# EAGLE design power_node (EAGLE 6.5.0)
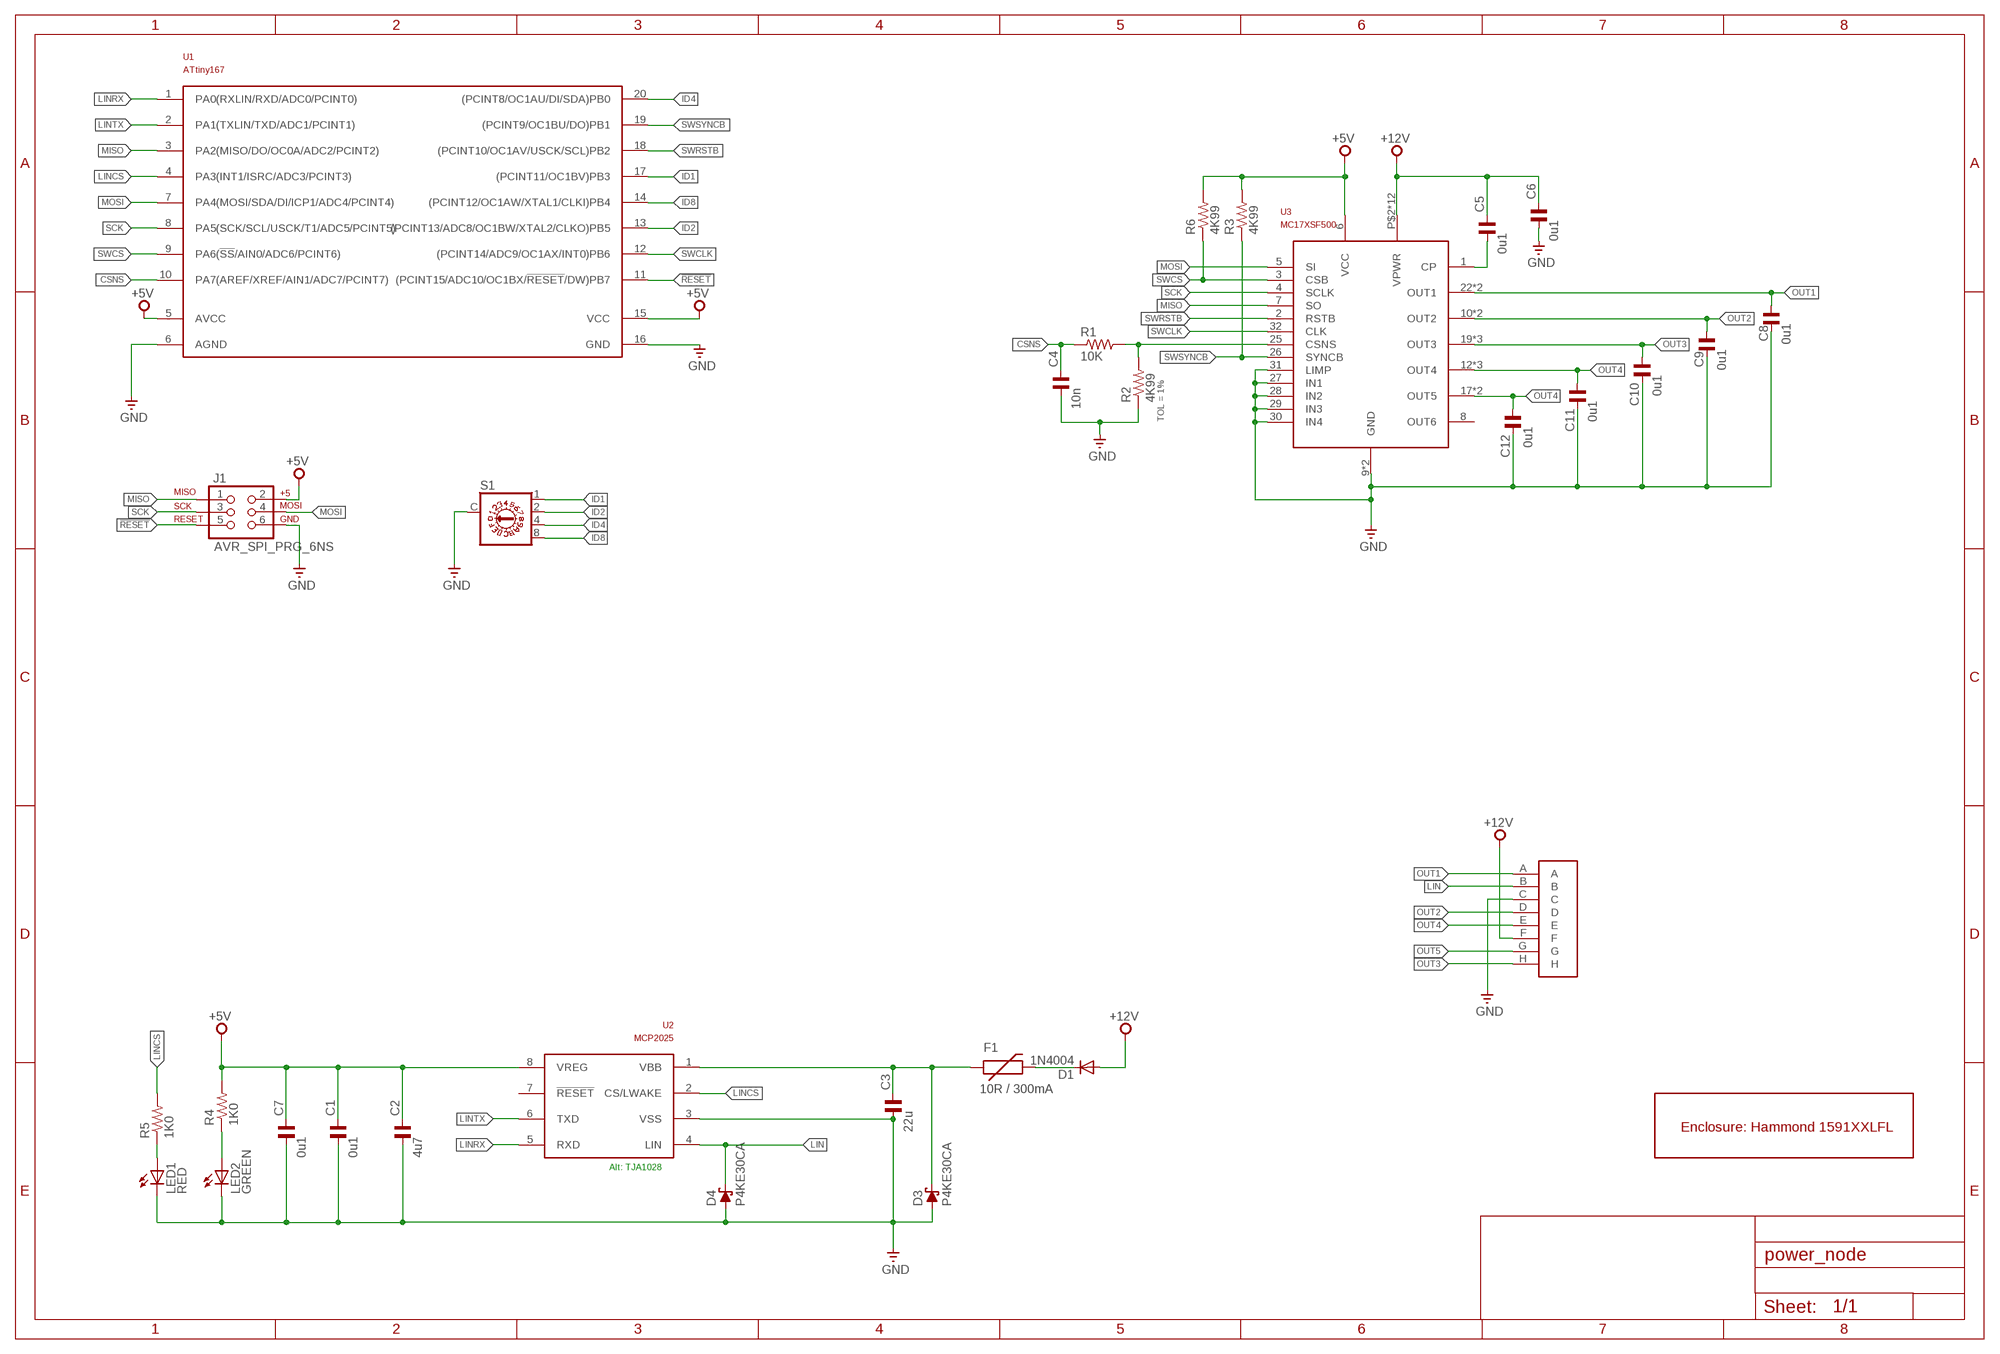
[diagram p0: schematic, sheet 1]

## Parts
C1  0u1  C-EU050-024X044  [C050-024X044]
C2  4u7  C-EU050-024X044  [C050-024X044]
C3  22u  C-EU050-024X044  [C050-024X044]
C4  10n  C-EU025-024X044  [C025-024X044]
C5  0u1  C-EU050-024X044  [C050-024X044]
C6  0u1  C-EU050-024X044  [C050-024X044]
C7  0u1  C-EU050-024X044  [C050-024X044]
C8  0u1  C-EUC0603K  [C0603K]
C9  0u1  C-EUC0603K  [C0603K]
C10  0u1  C-EUC0603K  [C0603K]
C11  0u1  C-EUC0603K  [C0603K]
C12  0u1  C-EUC0603K  [C0603K]
D1  1N4004  [DO41-10]
D3  P4KE30CA  P4KEXX  [DO41-10]
D4  P4KE30CA  P4KEXX  [DO41-10]
F1  10R / 300mA  PTCPTH  [PTC]
J1  AVR_SPI_PRG_6NS  [2X3-NS]
J2  12146734  [12146734]
LED1  RED  LED3MM  [LED3MM]
LED2  GREEN  LED3MM  [LED3MM]
R1  10K  R-EU_0207/10  [0207/10]
R2  4K99  R-EU_0207/10  [0207/10]
R3  4K99  R-EU_0207/10  [0207/10]
R4  1K0  R-EU_0207/10  [0207/10]
R5  1K0  R-EU_0207/10  [0207/10]
R6  4K99  R-EU_0207/10  [0207/10]
S1  P103  [P103]
U1  ATtiny167  ATTINY167  [SO20W]
U2  MCP2025  [SO08]
U3  MC17XSF500  [SOIC32W-EP]
U$1  1591XXLFL  [1591XXLFL]

## Nets
!RESET: J1.5 U1.11((PCINT15/ADC10/OC1BX/!RESET!/DW)PB7)
+5V [power]: C1.1 C2.1 C7.1 J1.2 R3.2 R4.2 R6.2 U1.5(AVCC) U1.15(VCC) U2.8(VREG) U3.6(VCC)
+12V [power]: C5.1 C6.1 D1.A J2.F U3.P$2(VPWR) U3.P$3(VPWR) U3.P$4(VPWR) U3.P$5(VPWR) U3.P$6(VPWR) U3.P$7(VPWR) U3.P$8(VPWR) U3.P$9(VPWR) U3.P$10(VPWR) U3.P$11(VPWR) U3.P$12(VPWR) U3.P$13(VPWR)
CSNS: C4.1 R1.1 U1.10(PA7(AREF/XREF/AIN1/ADC7/PCINT7))
GND [power]: C1.2 C2.2 C3.2 C4.2 C6.2 C7.2 C8.2 C9.2 C10.2 C11.2 C12.2 D3.A D4.A J1.6 J2.C LED1.K(C) LED2.K(C) R2.1 S1.C U1.6(AGND) U1.16(GND) U2.3(VSS) U3.9(GND) U3.24(GND) U3.27(IN1) U3.28(IN2) U3.29(IN3) U3.30(IN4) U3.31(LIMP)
ID1: S1.1 U1.17((PCINT11/OC1BV)PB3)
ID2: S1.2 U1.13((PCINT13/ADC8/OC1BW/XTAL2/CLKO)PB5)
ID4: S1.4 U1.20((PCINT8/OC1AU/DI/SDA)PB0)
ID8: S1.8 U1.14((PCINT12/OC1AW/XTAL1/CLKI)PB4)
LIN: D4.C J2.B U2.4(LIN)
LINCS: R5.2 U1.4(PA3(INT1/ISRC/ADC3/PCINT3)) U2.2(CS/LWAKE)
LINRX: U1.1(PA0(RXLIN/RXD/ADC0/PCINT0)) U2.5(RXD)
LINTX: U1.2(PA1(TXLIN/TXD/ADC1/PCINT1)) U2.6(TXD)
MISO: J1.1 U1.3(PA2(MISO/DO/OC0A/ADC2/PCINT2)) U3.7(SO)
MOSI: J1.4 U1.7(PA4(MOSI/SDA/DI/ICP1/ADC4/PCINT4)) U3.5(SI)
N$1: C5.2 U3.1(CP)
N$2 [power]: C3.1 D3.C F1.P$1 U2.1(VBB)
N$3: LED1.A R5.1
N$4: LED2.A R4.1
N$5 [power]: D1.C F1.P$2
N$6: R1.2 R2.2 U3.25(CSNS)
OUT1: C8.1 J2.A U3.22(OUT1) U3.23(OUT1)
OUT2: C9.1 J2.D U3.10(OUT2) U3.11(OUT2)
OUT3: C10.1 J2.H U3.19(OUT3) U3.20(OUT3) U3.21(OUT3)
OUT4: C11.1 J2.E U3.12(OUT4) U3.13(OUT4) U3.14(OUT4)
OUT5: C12.1 J2.G U3.17(OUT5) U3.18(OUT5)
SCK: J1.3 U1.8(PA5(SCK/SCL/USCK/T1/ADC5/PCINT5)) U3.4(SCLK)
SWCLK: U1.12((PCINT14/ADC9/OC1AX/INT0)PB6) U3.32(CLK)
SWCS: R6.1 U1.9(PA6(!SS!/AIN0/ADC6/PCINT6)) U3.3(CSB)
SWRSTB: U1.18((PCINT10/OC1AV/USCK/SCL)PB2) U3.2(RSTB)
SWSYNCB: R3.1 U1.19((PCINT9/OC1BU/DO)PB1) U3.26(SYNCB)
Unconnected: U2.7(!RESET) U3.8(OUT6)

## Notes on the sheet
- Alt: TJA1028

## Library data of the parts
C1 C5-C7 = custom:C-EU: CAPACITOR, European symbol; PARTNO: FK28X7R1H104K
C2 = custom:C-EU: CAPACITOR, European symbol; PARTNO: FK28X5R0J475K
C3 = custom:C-EU: CAPACITOR, European symbol; PARTNO: FK22X5R1E226M
C4 = custom:C-EU: CAPACITOR, European symbol; PARTNO: FK18X7R1H103K
C8-C12 = custom:C-EU: CAPACITOR, European symbol; PARTNO: C1608X7R1H104M080AA
D1 = custom:1N4004: DIODE general purpose rectifier, 1 A; PARTNO: 1N4004-TP
D3 D4 = custom:P4KEXX: DIODE transient-voltage suppressor; PARTNO: P4KE30CA
F1 = custom:PTC: Resettable Fuse PTC Resettable Fuse. Spark Fun Electronics SKU : COM-08357; PARTNO: CMF-RL10-0
J1 = custom:AVR_SPI_PRG_6: AVR ISP 6 Pin This is the reduced ISP connector for AVR programming. Common on Arduino. This footprint will take up less PCB space and can be used with a 10-pin to 6-pin adapter such as SKU: BOB-08508
J2 = custom:12146734; PARTNO: 12146724-B
LED1 = custom:LED: LEDs Standard schematic elements and footprints for 5mm, 3mm, 1206, and 0603 sized LEDs. 5mm - Spark Fun Electronics SKU : COM-00529 (and others); PARTNO: C4SMF-RJS-CT0W0BB2
LED2 = custom:LED: LEDs Standard schematic elements and footprints for 5mm, 3mm, 1206, and 0603 sized LEDs. 5mm - Spark Fun Electronics SKU : COM-00529 (and others); PARTNO: C4SMF-GJS-CV0Y0792
R1 = custom:R-EU_: RESISTOR, European symbol; PARTNO: CF14JT10K0
R2 = custom:R-EU_: RESISTOR, European symbol; PARTNO: MFR-25FBF52-4K99; TOL: 1%
R3 R6 = custom:R-EU_: RESISTOR, European symbol; PARTNO: MFR-25FBF52-4K99
R4 R5 = custom:R-EU_: RESISTOR, European symbol; PARTNO: CF14JT1K00
S1 = custom:P103: DIL/CODE SWITCH; PARTNO: SH-7050MC
U1 = custom:ATTINY167; PARTNO: ATTINY167-SU
U2 = custom:MCP2025: LIN Transceiver with Voltage Regulator; PARTNO: MCP2025-500E/SN
U3 = custom:MC17XSF500; PARTNO: MC17XSF500EK
U$1 = custom:1591XXLFL; PARTNO: 1591XXLFLBK

## Net classes
0 default: width 0.381 mm
1 power: width 0.635 mm

## Board
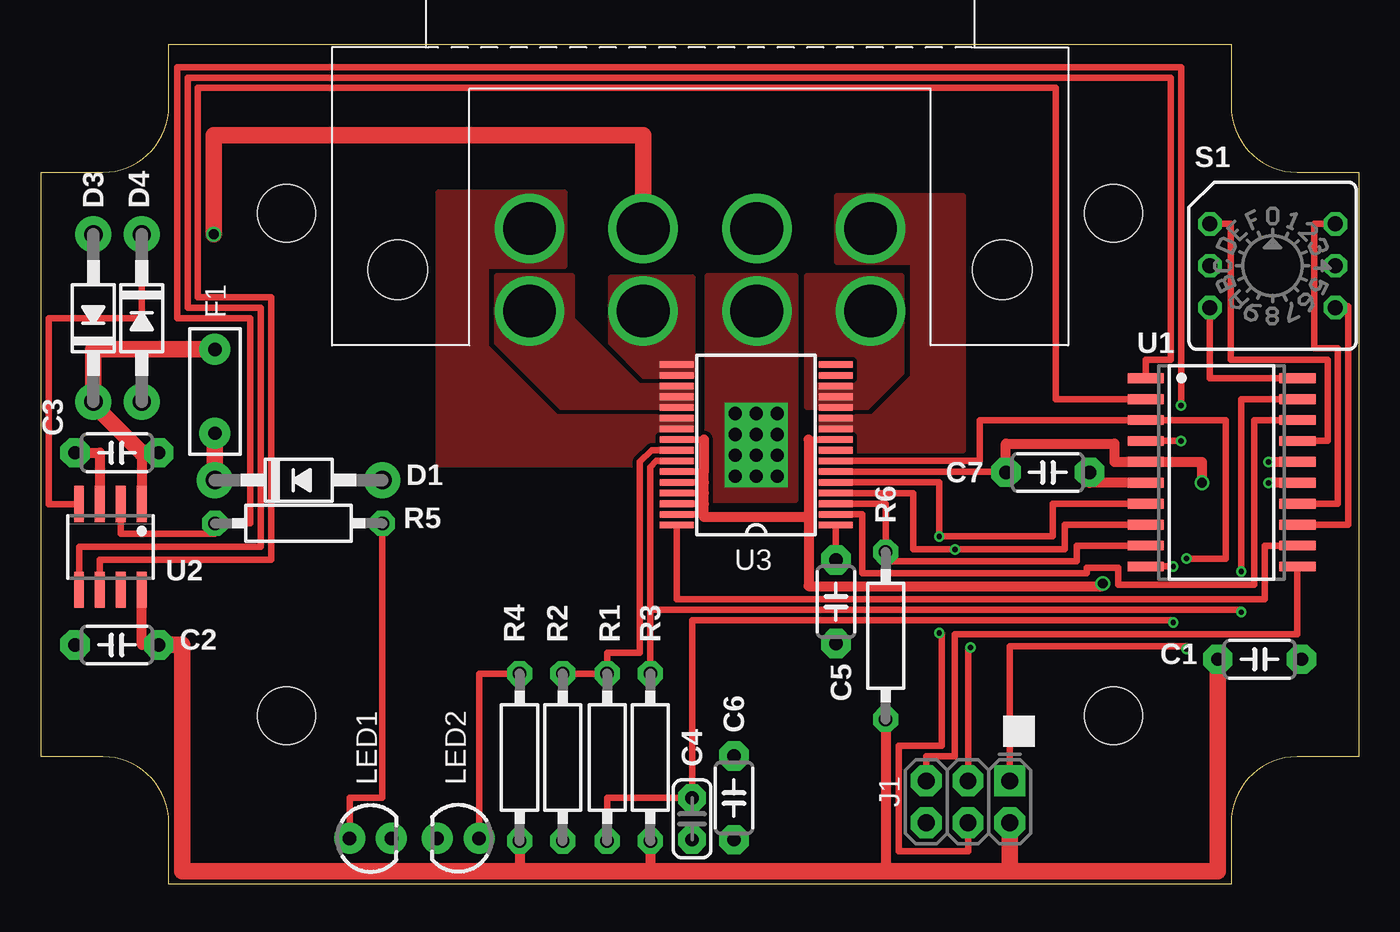
[diagram p1: board, top side]
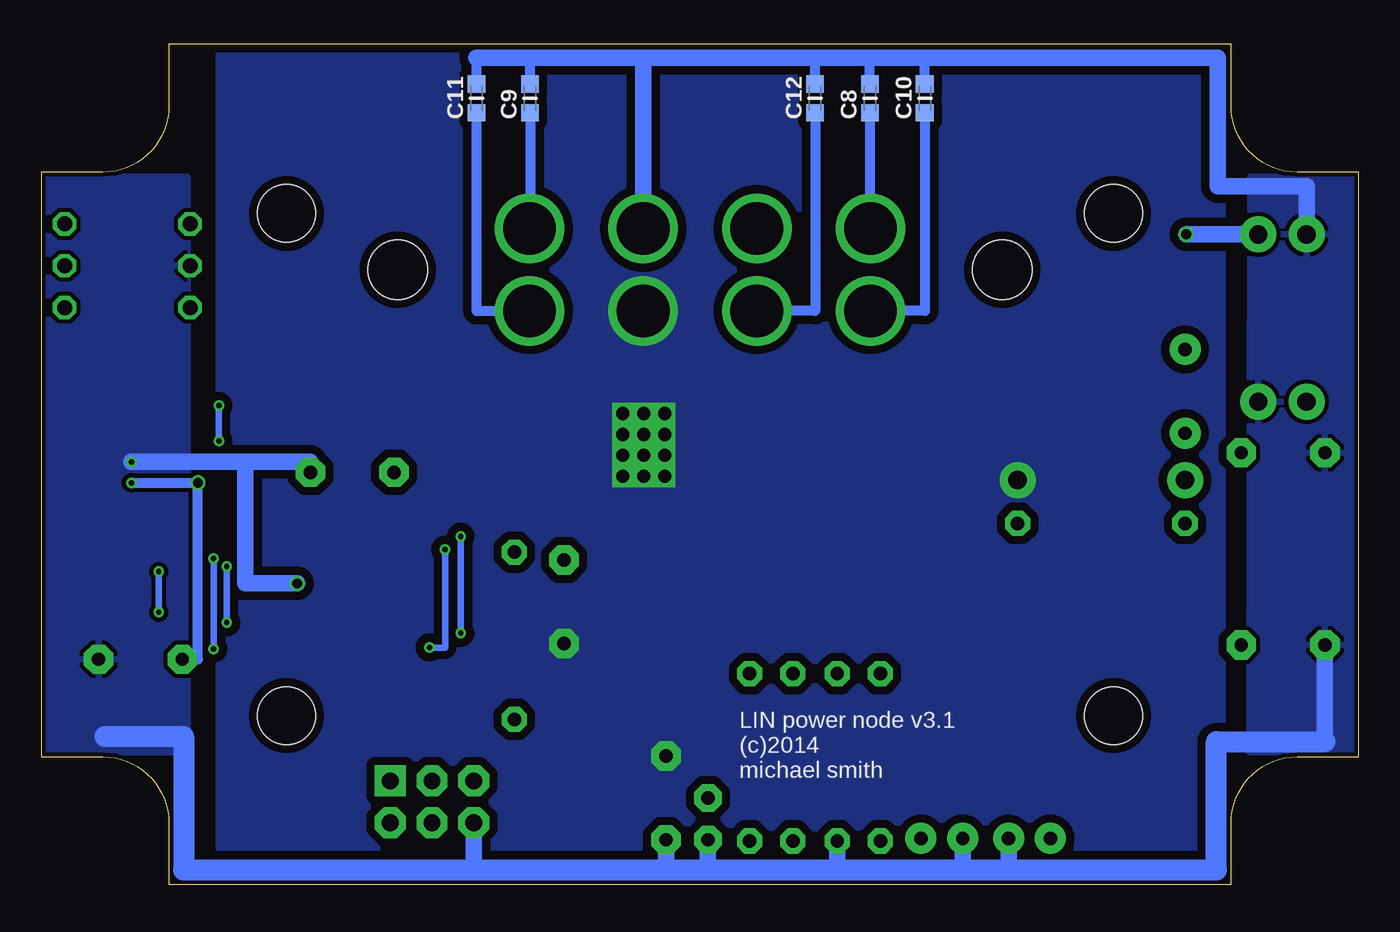
[diagram p2: board, bottom side, seen from below]

Size 80 x 51 mm. Coordinates in mm from the lower left corner, seen from the top.
Copper layers (1*16): Top 0.035mm / dielectric 1.5mm / Bottom 0.035mm
Design rules "dirt_cheap_dirty_boards.v1": minimum track width 5mil, minimum drill 12mil, track to track 5mil, track to pad 5mil, pad to pad 5mil, via to via 5mil, smd to smd 0mil, copper to edge 10mil, drill to drill 10mil, minimum pad ring 10mil, minimum via ring 6mil, stop-mask expansion 2mil, vias tented up to drill 25mil, thermal gap 10mil

### Footprints (pad centres in the part's own frame; a part is rotated, then mirrored left to right if it is on the bottom)
C050-024X044 = drill 0.813 pad 1.778 octagon: 1 -2.54,0; 2 2.54,0
C025-024X044 = drill 0.813 pad 1.676 octagon: 1 -1.27,0; 2 1.27,0
C0603K = smd 1.05 x 1.08: 1 -0.875,0; 2 0.875,0
DO41-10 = drill 1.118 pad 2.184: A 5.08,0; C -5.08,0
PTC = drill 0.8 pad 1.88: P$1 -2.54,0; P$2 2.54,0
2X3-NS = drill 1.016 pad 1.88 square: 1 -2.54,-1.27 | drill 1.016 pad 1.88 octagon: 2 -2.54,1.27; 3 0,-1.27; 4 0,1.27; 5 2.54,-1.27; 6 2.54,1.27
12146734 = drill 3.2: A 10.35,-2.5; B 3.45,-2.5; C -3.45,-2.5; D -10.35,-2.5; E -10.35,2.5; F -3.45,2.5; G 3.45,2.5; H 10.35,2.5 | hole 3.6: 18.35,0; -18.35,0
LED3MM = drill 0.813 pad 1.88: A -1.27,0; K 1.27,0
0207/10 = drill 0.813 pad 1.524 octagon: 1 -5.08,0; 2 5.08,0
P103 = drill 0.914 octagon: 1 3.81,-2.54; 2 -3.81,2.54; 4 3.81,2.54; 8 -3.81,-2.54; C 3.81,0; C1 -3.81,0
SO20W = smd 0.6 x 2.2: 1 -5.715,-4.6; 2 -4.445,-4.6; 3 -3.175,-4.6; 4 -1.905,-4.6; 5 -0.635,-4.6; 6 0.635,-4.6; 7 1.905,-4.6; 8 3.175,-4.6; 9 4.445,-4.6; 10 5.715,-4.6; 11 5.715,4.6; 12 4.445,4.6; 13 3.175,4.6; 14 1.905,4.6; 15 0.635,4.6; 16 -0.635,4.6; 17 -1.905,4.6; 18 -3.175,4.6; 19 -4.445,4.6; 20 -5.715,4.6
SO08 = smd 0.6 x 2.2: 1 -1.905,-2.6; 2 -0.635,-2.6; 3 0.635,-2.6; 4 1.905,-2.6; 5 1.905,2.6; 6 0.635,2.6; 7 -0.635,2.6; 8 -1.905,2.6
SOIC32W-EP = smd 2.05 x 0.4: 1 -4.825,4.875; 2 -4.825,4.225; 3 -4.825,3.575; 4 -4.825,2.925; 5 -4.825,2.275; 6 -4.825,1.625; 7 -4.825,0.975; 8 -4.825,0.325; 9 -4.825,-0.325; 10 -4.825,-0.975; 11 -4.825,-1.625; 12 -4.825,-2.275; 13 -4.825,-2.925; 14 -4.825,-3.575; 15 -4.825,-4.225; 16 -4.825,-4.875; 17 4.825,-4.875; 18 4.825,-4.225; 19 4.825,-3.575; 20 4.825,-2.925; 21 4.825,-2.275; 22 4.825,-1.625; 23 4.825,-0.975; 24 4.825,-0.325; 25 4.825,0.325; 26 4.825,0.975; 27 4.825,1.625; 28 4.825,2.275; 29 4.825,2.925; 30 4.825,3.575; 31 4.825,4.225; 32 4.825,4.875 | drill 0.8 square: P$2 1.27,1.905; P$3 0,1.905; P$4 -1.27,1.905; P$5 1.27,0.635; P$6 0,0.635; P$7 -1.27,0.635; P$8 1.27,-0.635; P$9 0,-0.635; P$10 -1.27,-0.635; P$11 1.27,-1.905; P$12 0,-1.905; P$13 -1.27,-1.905
1591XXLFL = hole 3.5: -25.1,15.25; 25.1,15.25; -25.1,-15.25; 25.1,-15.25

### Placement (x,y rotation side)
C1  73.97,13.67 0 top
C2  4.6,14.55 180 top
C3  4.6,26.21 180 top
C4  39.52,3.99 270 top
C5  48.26,17.17 90 top
C6  42.06,5.26 270 top
C7  61.11,25.02 0 top
C8  29.68,47.73 90 bottom
C9  50.32,47.73 90 bottom
C10  26.35,47.73 90 bottom
C11  53.57,47.73 90 bottom
C12  33.02,47.73 90 bottom
D1  15.63,24.55 0 top
D3  3.17,34.39 90 top
D4  6.11,34.39 270 top
F1  10.55,29.95 270 top
J1  56.27,5.02 180 top
J2  40,37.33 180 top
LED1  20,2.8 0 top
LED2  25.32,2.8 180 top
R1  34.36,7.72 90 top
R2  31.67,7.72 90 top
R3  36.98,7.72 270 top
R4  29.05,7.72 270 top
R5  15.63,21.93 180 top
R6  51.27,15.1 270 top
S1  74.77,37.56 180 top
U1  71.67,25.02 270 top
U2  4.2,20.5 180 top
U3  43.41,26.69 180 top
U$1  40,25.5 0 top

### Tracks (layer width: path | path; a pad name or v marks a point on that pad's centre or on a via)
!RESET
  Top 0.381: U1.11 76.27,15.18 55.48,15.18 55.48,7.8 53.73,7.8 J1.5
+5V  (via drill 0.33, 0.6)
  Top 0.381: U3.6 58.57,25.07
  Top 0.406: 58.57,25.07 C7.1
  Top 0.61: C2.1 6.11,14.55 U2.8 | R3.2 36.98,0.81 | C7.1 58.57,26.77 65.16,26.77 65.16,25.66 U1.5 70.48,25.66 v70.48,24.39 | R6.2 51.27,0.81 | U1.15 v74.53,24.39 | R4.2 29.05,0.81
  Top 1.016: C2.1 8.57,14.55 8.57,0.81 29.05,0.81 36.98,0.81 51.27,0.81 58.81,0.81 | 58.81,0.81 71.43,0.81 C1.1 | J1.2 58.81,0.81
  Bottom 0.61: v74.53,24.39 v70.48,24.39 70.48,13.67 C1.1
+12V
  pour Top (isolate 0.254, no thermals): 40.48,23.36 45.79,23.36 45.79,36.93 40.48,36.93
  pour Bottom (isolate 0.508, no thermals): 8.25,2 69.21,2 69.21,50.9 8.25,50.9
CSNS  (via drill 0.33)
  Top 0.381: v68.73,15.9 68.73,16.05 39.52,16.05 C4.1 34.36,5.26 R1.1 | v68.73,19.31 U1.10
  Bottom 0.381: v68.73,15.9 v68.73,19.31
GND  (via drill 0.33, 0.6)
  Top 0.381: U3.24 40.24,27.02 | 40.24,25.07 U3.27 | U3.28 40.24,24.42 | U3.29 40.24,23.77 | U3.30 40.24,23.12 | U3.31 40.16,22.47 40.24,22.48
  Top 0.406: U3.9 46.59,27.02
  Top 0.61: 40.24,27.02 40.24,25.07 40.24,24.42 40.24,23.77 40.24,23.12 40.24,22.48 40.24,22.33 46.59,22.33 | 46.59,27.02 46.59,22.33 | 46.59,22.33 46.59,18.12 64.45,18.12 v64.45,18.28 | C3.2 3.57,26.21 U2.3 | U1.6 63.65,24.39 C7.2 | v74.53,25.66 U1.16
  Bottom 0.61: 53.57,50.19 C11.2 | C10.2 26.35,50.19 | C8.2 29.68,50.19 | C12.2 33.02,50.19 | C9.2 50.32,50.19
  Bottom 1.016: 2.06,8.67 C2.2 | LED1.K 21.27,0.89 | LED2.K 24.05,0.89 | R2.1 31.67,0.89 | J1.6 53.73,0.89 | 43.45,50.19 33.02,50.19 29.68,50.19 26.35,50.19 8.57,50.19 8.57,42.41 3.17,42.41 D3.A | 43.45,50.19 50.32,50.19 53.57,50.19 | J2.C 43.45,50.19 | C4.2 39.52,0.89 39.37,0.89 | C6.2 42.06,0.89 41.91,0.89 | v74.53,25.66 67.62,25.66 | 67.62,25.66 63.65,25.66 C7.2 | v64.45,18.28 67.62,18.28 67.62,25.66
  Bottom 1.27: 76.12,8.99 71.35,8.99 71.35,0.89 53.73,0.89 41.91,0.89 39.37,0.89 31.67,0.89 24.05,0.89 21.27,0.89 8.65,0.89 8.65,8.67 2.06,8.67
  pour Bottom (isolate 0.254): 0.23,42.96 6.58,42.96 6.66,8.04 0.31,8.04
  pour Bottom (isolate 0.254): 79.69,8.04 71.11,8.04 71.11,42.96 79.69,42.96
ID1
  Top 0.381: S1.1 72.23,40.1 72.23,31.85 78.1,31.85 78.1,26.93 U1.17
ID2
  Top 0.381: U1.13 79.37,21.85 79.37,35.1 78.58,35.1 S1.2
ID4
  Top 0.381: S1.4 70.95,30.74 U1.20
ID8
  Top 0.381: S1.8 77.31,40.1 77.31,32.56 78.73,32.56 78.73,23.12 U1.14
LIN  (via drill 0.6)
  Top 0.381: 2.3,23.12 U2.4 0.47,23.1 0.47,34.39 6.11,34.39 D4.C
  Top 1.016: J2.B 36.55,45.5 10.47,45.5 v10.47,39.47
  Bottom 1.016: D4.C v10.47,39.47
LINCS  (via drill 0.33)
  Top 0.381: U1.4 v69.21,26.93 | U2.2 4.84,21.29 10.55,21.29 R5.2 12.7,21.93 12.7,34.39 8.25,34.39 8.25,49.63 69.21,49.63 v69.21,29.07
  Bottom 0.381: v69.21,26.93 v69.21,29.07
LINRX
  Top 0.381: U1.1 67.07,31.85 68.58,31.85 68.58,48.99 8.89,48.99 8.89,35.02 13.33,35.02 13.33,20.5 2.3,20.5 U2.5
LINTX
  Top 0.381: U1.2 61.59,29.47 61.59,48.36 9.52,48.36 9.52,35.66 13.96,35.66 13.96,19.71 3.57,19.71 U2.6
MISO  (via drill 0.33)
  Top 0.381: v69.53,14.31 69.53,14.47 58.81,14.47 J1.1 | v69.53,19.79 71.91,19.79 71.91,28.2 U1.3
  Top 0.406: U3.7 56.99,25.72 56.99,28.2 U1.3
  Bottom 0.381: v69.53,14.31 v69.53,19.79
MOSI  (via drill 0.33)
  Top 0.381: U3.5 54.53,24.42 v54.53,21.13 61.43,21.13 61.43,23.12 U1.7 | v54.53,15.26 54.68,15.26 54.68,8.43 52.06,8.43 52.06,2 56.27,2 J1.4
  Bottom 0.381: v54.53,21.13 v54.53,15.26
N$1
  Top 0.381: C5.2 48.26,21.82 U3.1
N$2
  Top 0.61: 6.11,26.21 U2.1
  Top 1.016: C3.1 6.11,26.21 3.17,29.15 D3.C 3.17,32.48 F1.P$1
N$3
  Top 0.381: LED1.A 18.73,5.26 20.71,5.26 R5.1
N$4
  Top 0.381: LED2.A 26.59,12.8 R4.1
N$5
  Top 1.016: D1.C F1.P$2
N$6
  Top 0.381: R2.2 R1.2 34.36,14.07 36.35,14.07 36.35,25.66 37.06,26.37 U3.25
OUT1
  Bottom 0.61: C8.1 29.68,39.83 J2.A
  pour Top (isolate 0.254, no thermals): 31.74,42.01 24.12,42.01 24.12,25.5 36.03,25.5 37.3,26.93 39.44,26.93 39.44,28.36 31.27,28.36 26.98,32.64 26.98,37.56 31.74,37.56
OUT2
  Bottom 0.61: C9.1 50.32,39.83 J2.D
  pour Top (isolate 0.254, no thermals): 47.38,28.36 50.48,28.36 52.94,30.82 52.94,37.8 48.33,37.8 48.33,41.77 55.95,41.77 55.95,26.37 47.38,26.37
OUT3
  Bottom 0.61: C10.1 26.35,34.83 J2.H
  pour Top (isolate 0.254, no thermals): 39.44,30.26 36.27,30.26 32.22,34.31 32.22,36.93 27.7,36.93 27.7,32.88 31.59,28.99 39.44,28.99
OUT4
  Bottom 0.61: C11.1 53.57,34.83 J2.E
  pour Top (isolate 0.254, no thermals): 52.22,36.93 52.22,31.06 50.16,28.99 46.51,28.99 46.51,36.93
OUT5
  Bottom 0.61: C12.1 33.02,34.83 J2.G
  pour Top (isolate 0.254, no thermals): 34.6,36.85 34.6,32.88 36.59,30.9 39.52,30.9 39.52,36.85
SCK  (via drill 0.33)
  Top 0.381: U3.4 52.94,23.77 52.94,20.34 v55.48,20.34 62.15,20.34 62.15,21.85 U1.8 | v56.43,14.39 56.27,14.39 J1.3
  Bottom 0.381: v55.48,20.34 55.48,14.39 v56.43,14.39
SWCLK
  Top 0.381: U1.12 74.29,20.58 74.29,17.32 38.59,17.32 U3.32
SWCS
  Top 0.381: U3.3 51.27,23.12 R6.1 51.27,19.63 62.86,19.63 62.86,20.58 U1.9
SWRSTB
  Top 0.381: U3.2 49.84,22.47 49.84,18.91 63.5,18.91 63.5,19.23 65.4,19.23 65.4,18.2 73.66,18.2 73.66,28.2 U1.18
SWSYNCB  (via drill 0.33)
  Top 0.381: 36.98,16.69 36.98,25.34 37.36,25.72 U3.26 | 36.98,16.69 72.86,16.69 v72.86,16.53 | R3.1 36.98,16.69 | U1.19 72.86,29.47 v72.86,18.99
  Bottom 0.381: v72.86,18.99 v72.86,16.53

### Text on the board
bNames: LIN power node v3.1 / (c)2014 / michael smith